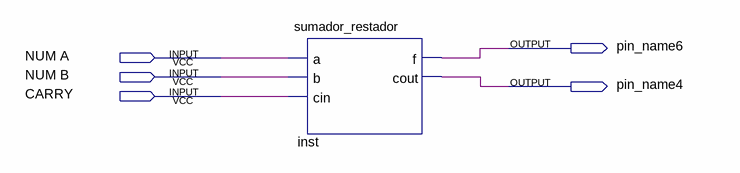
[diagram p0: schematic sheet]
// Quartus schematic Block1.bdf as structural Verilog: 1 symbols, 5 pins
module Block1 (
  input  \NUM_A ,
  input  \NUM_B ,
  input  CARRY,
  output pin_name6,
  output pin_name4
);

  sumador_restador inst (.a(\NUM_A ), .b(\NUM_B ), .cin(CARRY), .f(pin_name6), .cout(pin_name4));
endmodule
